# EAGLE design BME680_Breakout (EAGLE 7.6.0)
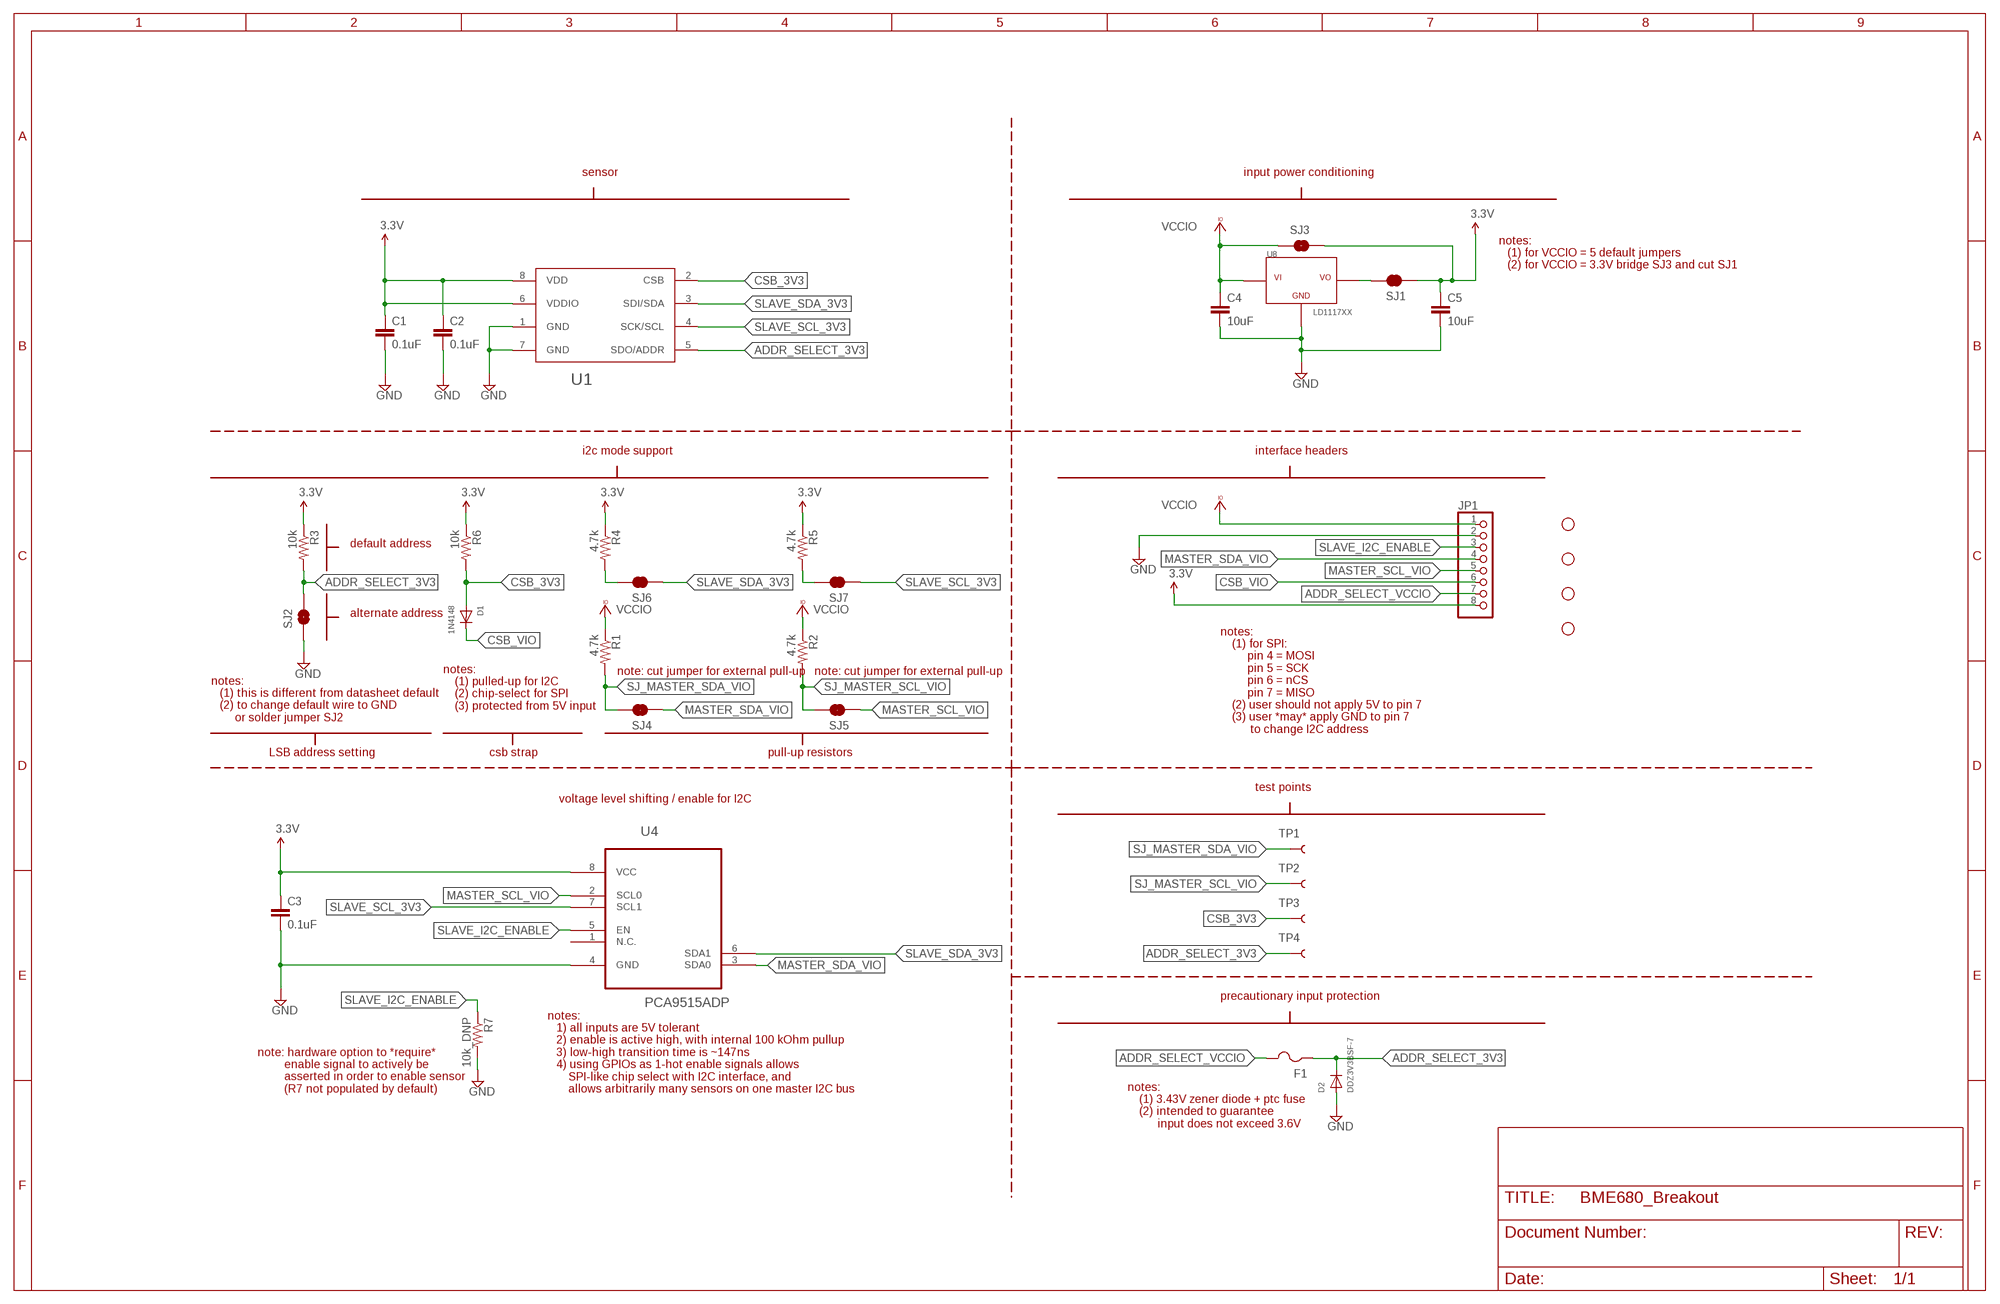
[diagram p0: schematic, sheet 1]

## Parts
C1  0.1uF  CAP0805  [0805]
C2  0.1uF  CAP0805  [0805]
C3  0.1uF  CAP0805  [0805]
C4  10uF  CAP0805  [0805]
C5  10uF  CAP0805  [0805]
D1  1N4148  DIODESOD-323F  [SOD-323F]
D2  DDZ3V3BSF-7  DIODESOD-323F  [SOD-323F]
F1  PTCFUSE-1812  [1812]
JP1  PINHD-1X8  [1X08]
R1  4.7k  RESISTOR0805-RES  [0805]
R2  4.7k  RESISTOR0805-RES  [0805]
R3  10k  RESISTOR0805-RES  [0805]
R4  4.7k  RESISTOR0805-RES  [0805]
R5  4.7k  RESISTOR0805-RES  [0805]
R6  10k  RESISTOR0805-RES  [0805]
R7  10k_DNP  RESISTOR0805-RES  [0805]
SJ1  JUMPER-PAD-2-NC_BY_TRACE  [PAD-JUMPER-2-NC_BY_TRACE_YES_SILK]
SJ2  JUMPER-PAD-2-NOYES_SILK  [PAD-JUMPER-2-NO_YES_SILK]
SJ3  SOLDERJUMPERNC2  [SJ_2S-NOTRACE]
SJ4  JUMPER-PAD-2-NC_BY_TRACE  [PAD-JUMPER-2-NC_BY_TRACE_YES_SILK]
SJ5  JUMPER-PAD-2-NC_BY_TRACE  [PAD-JUMPER-2-NC_BY_TRACE_YES_SILK]
SJ6  JUMPER-PAD-2-NC_BY_TRACE  [PAD-JUMPER-2-NC_BY_TRACE_YES_SILK]
SJ7  JUMPER-PAD-2-NC_BY_TRACE  [PAD-JUMPER-2-NC_BY_TRACE_YES_SILK]
STANDOFF1  STAND-OFF  [STAND-OFF]
STANDOFF2  STAND-OFF  [STAND-OFF]
STANDOFF3  STAND-OFF  [STAND-OFF]
STANDOFF4  STAND-OFF  [STAND-OFF]
TP1  TEST-POINT3X4  [PAD.03X.04]
TP2  TEST-POINT3X4  [PAD.03X.04]
TP3  TEST-POINT3X4  [PAD.03X.04]
TP4  TEST-POINT3X4  [PAD.03X.04]
U1  BME680  [BME680]
U4  PCA9515ADP  [SOT505-1]
U8  LD1117XX  [DPAK]

## Nets
3.3V: C1.1 C2.1 C3.1 C5.1 JP1.8 R3.1 R4.1 R5.1 R6.1 SJ1.1 SJ3.2 U1.6(VDDIO) U1.8(VDD) U4.8(VCC)
ADDR_SELECT_3V3: D2.C F1.1 R3.2 SJ2.2 TP4.P$1 U1.5(SDO/ADDR)
ADDR_SELECT_VCCIO: F1.2 JP1.7
CSB_3V3: D1.A R6.2 TP3.P$1 U1.2(CSB)
CSB_VIO: D1.C JP1.6
GND: C1.2 C2.2 C3.2 C4.2 C5.2 D2.A JP1.2 R7.2 SJ2.1 U1.1(GND) U1.7(GND) U4.4(GND) U8.1(GND)
MASTER_SCL_VIO: JP1.5 SJ5.1 U4.2(SCL0)
MASTER_SDA_VIO: JP1.4 SJ4.1 U4.3(SDA0)
N$1: SJ1.2 U8.4(VO)
N$3: R4.2 SJ6.2
N$4: R5.2 SJ7.2
SJ_MASTER_SCL_VIO: R2.2 SJ5.2 TP2.P$1
SJ_MASTER_SDA_VIO: R1.2 SJ4.2 TP1.P$1
SLAVE_I2C_ENABLE: JP1.3 R7.1 U4.5(EN)
SLAVE_SCL_3V3: SJ7.1 U1.4(SCK/SCL) U4.7(SCL1)
SLAVE_SDA_3V3: SJ6.1 U1.3(SDI/SDA) U4.6(SDA1)
VCCIO: C4.1 JP1.1 R1.1 R2.1 SJ3.1 U8.3(VI)
Unconnected: U4.1(N.C.)

## Notes on the sheet
- sensor | input power conditioning
- notes: 
     (1) for VCCIO = 5 default jumpers
     (2) for VCCIO = 3.3V bridge SJ3 and cut SJ1
- i2c mode support | interface headers
- default address
- alternate address
- note: cut jumper for external pull-up | note: cut jumper for external pull-up
- notes:
      (1) pulled-up for I2C
      (2) chip-select for SPI
      (3) protected from 5V input
- notes:
     (1) this is different from datasheet default
     (2) to change default wire to GND
          or solder jumper SJ2
- notes:
      (1) for SPI:
           pin 4 = MOSI
           pin 5 = SCK
           pin 6 = nCS
           pin 7 = MISO
      (2) user should not apply 5V to pin 7
      (3) user *may* apply GND to pin 7
            to change I2C address
- LSB address setting | csb strap | pull-up resistors
- test points
- voltage level shifting / enable for I2C
- precautionary input protection
- note: hardware option to *require* 
           enable signal to actively be 
           asserted in order to enable sensor
           (R7 not populated by default)
- notes:
     1) all inputs are 5V tolerant
     2) enable is active high, with internal 100 kOhm pullup
     3) low-high transition time is ~147ns
     4) using GPIOs as 1-hot enable signals allows
         SPI-like chip select with I2C interface, and
         allows arbitrarily many sensors on one master I2C bus
- notes: 
      (1) 3.43V zener diode + ptc fuse
      (2) intended to guarantee
            input does not exceed 3.6V

## Library data of the parts
C1-C5 = SparkFun-Passives:CAP: Capacitor Standard 0603 ceramic capacitor, and 0.1" leaded capacitor.
D1 D2 = adafruit:DIODE: Diode SMADIODE - SMA Surface Mount Package 20V 1A Schottky Diode Digikey: 641-1014-6-ND DO-1N4148 - Through Hole Small Current Diode SOD-123 20V 1 A (.5mV Vf) Schottky Diode - Digikey: MBRX120TPMSCT-ND SOD-323 10V 570mA (.38mV Vf, 3ns) Schottky Diode - Digikey: ZLLS410CT-ND SOD-523 30V 30mA Schottky Diode (RB751S-40TE61) - Digikey: RB751S-40TE61CT-ND SOT23-R/W - SOT23 Package (R = Solder Paste/Reflow Ovens, W = Hand-Soldering) BAT54Film 40V 300mA - Digikey: 497-7162-1-ND
F1 = adafruit:PTCFUSE: PTC fuses, resettable thermistors
JP1 = pinhead:PINHD-1X8: PIN HEADER
R1-R7 = SparkFun-Passives:RESISTOR: Resistor Basic schematic elements and footprints for 0603, 1206, and PTH resistors.
SJ1 SJ4-SJ7 = SparkFun-Passives:JUMPER-PAD-2-NC_BY_TRACE
SJ2 = SparkFun-Passives:JUMPER-PAD-2-NO
SJ3 = SparkFun-Retired:SOLDERJUMPER: Solder Jumper Standard SMD solder jumper. Used to automate production. Two varients : Normally Open and Normally Closed are the same, but have different paste layers. NC will have a large amount of paste and should jumper during reflow.
STANDOFF1-STANDOFF4 = SparkFun-Electromechanical:STAND-OFF: #4 Stand Off This is the mechanical footprint for a #4 phillips button head screw. Use the keepout ring to avoid running the screw head into surrounding components. SKU : PRT-00447
TP1-TP4 = SparkFun-Passives:TEST-POINT: Bare copper test points for troubleshooting or ICT
U1 = wicked-device:BME680
U4 = PCA9515ADP:PCA9515A
U8 = wicked-device:LD1117XX

## Board
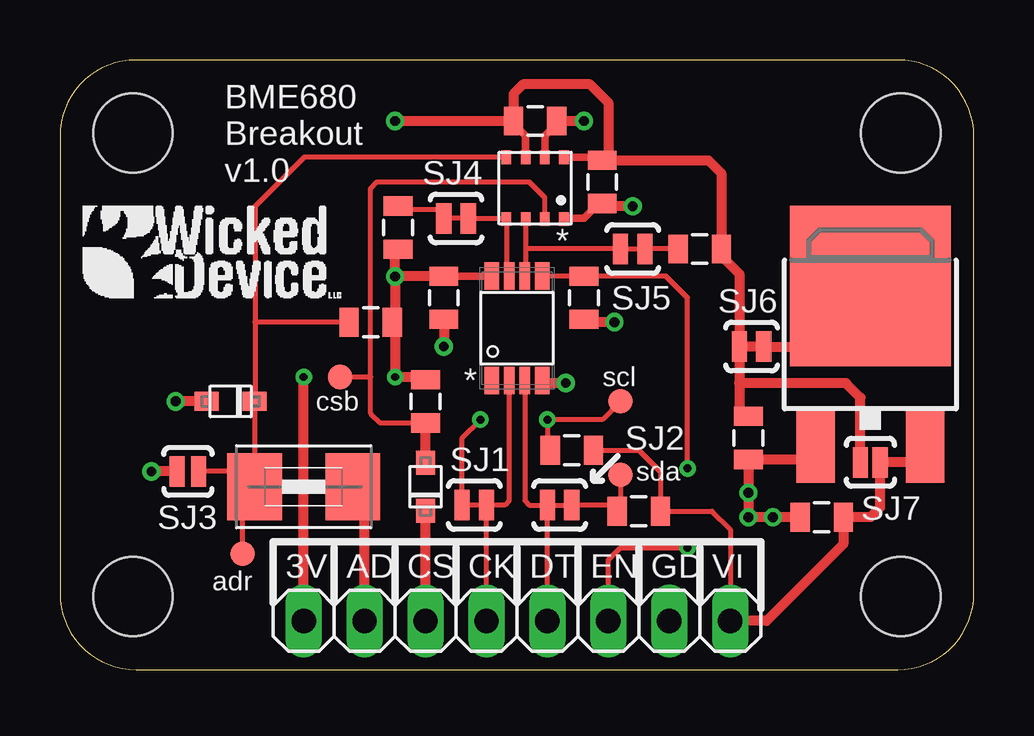
[diagram p1: board, top side]
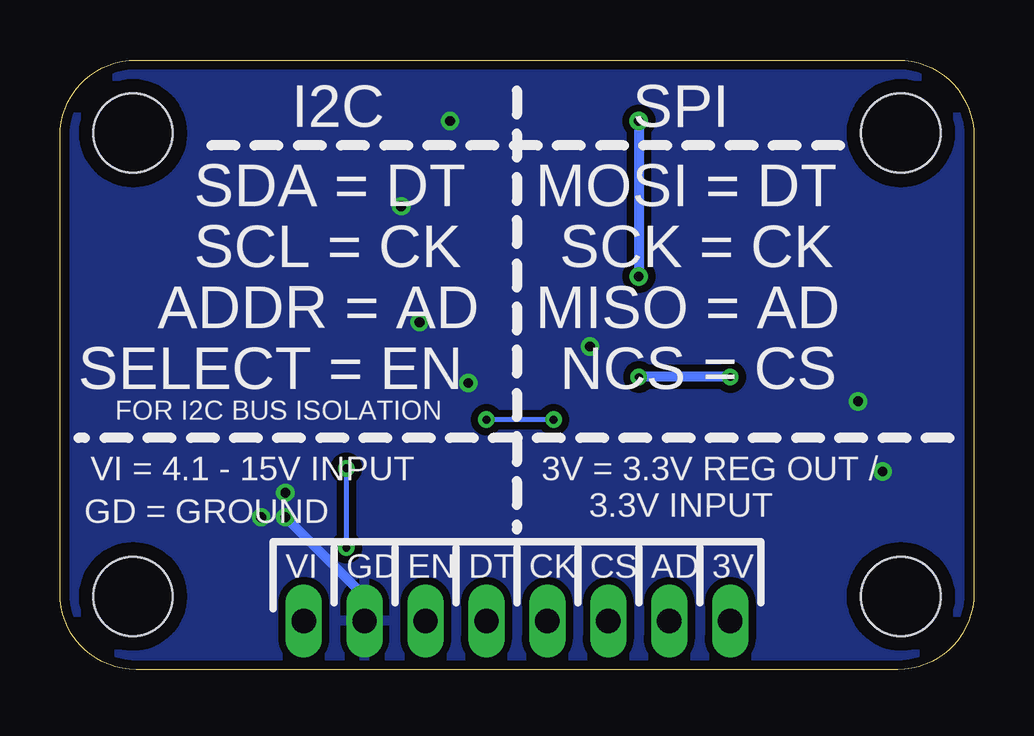
[diagram p2: board, bottom side, seen from below]

Size 38.1 x 25.4 mm. Coordinates in mm from the lower left corner, seen from the top.
Outline: 0,22.23 0,3.17 arc90 3.17,0 34.92,0 arc90 38.1,3.17 38.1,22.23 arc90 34.92,25.4 3.17,25.4 arc90 0,22.23
Copper layers (1*16): Top 0.0356mm / dielectric 1.5011mm / Bottom 0.0356mm
Design rules "oshpark-2layer *": minimum track width 6mil, minimum drill 13mil, track to track 6mil, track to pad 6mil, pad to pad 6mil, via to via 6mil, smd to smd 6mil, copper to edge 15mil, drill to drill 6mil, minimum pad ring 7mil, minimum via ring 7mil, stop-mask expansion 2.5mil, vias tented up to drill 16mil, thermal gap 10mil

### Footprints (pad centres in the part's own frame; a part is rotated, then mirrored left to right if it is on the bottom)
0805 = smd 0.8 x 1.2: 1 -0.9,0; 2 0.9,0
SOD-323F = smd 1 x 0.8: A -1,0; C 1,0
1812 = smd 2.286 x 2.794: 1 -2.046,0; 2 2.046,0
1X08 = drill 1.016 long: 1 -8.89,0; 2 -6.35,0; 3 -3.81,0; 4 -1.27,0; 5 1.27,0; 6 3.81,0; 7 6.35,0; 8 8.89,0
PAD-JUMPER-2-NC_BY_TRACE_YES_SILK = smd 0.635 x 1.27: 1 -0.508,0; 2 0.508,0
PAD-JUMPER-2-NO_YES_SILK = smd 0.635 x 1.27: 1 -0.45,0; 2 0.45,0
SJ_2S-NOTRACE = smd 0.635 x 1.27: 1 -0.401,0; 2 0.413,0
STAND-OFF = hole 3.302: 0,0
PAD.03X.04 = smd 1.016 x 1.016: P$1 0,0
BME680 = smd 0.575 x 0.4: 1 1.288,1.2; 2 1.288,0.4; 3 1.288,-0.4; 4 1.288,-1.2; 5 -1.288,-1.2; 6 -1.288,-0.4; 7 -1.288,0.4; 8 -1.288,1.2
SOT505-1 = smd 0.6 x 1.15: 1 -1.05,-2.175; 4 1.05,-2.175; 5 1.05,2.175; 8 -1.05,2.175 | smd 0.45 x 1.15: 2 -0.325,-2.175; 3 0.325,-2.175; 6 0.325,2.175; 7 -0.325,2.175
DPAK = smd 1.6 x 3: 1 -2.28,-2.91; 3 2.28,-2.91 | smd 6.7 x 6.7: 4 0,3.788

### Placement (x,y rotation side)
C1  19.81,22.86 0 top
C2  22.61,20.32 270 top
C3  16,15.49 270 top
C4  31.75,6.35 180 top
C5  28.7,9.65 270 top
D1  15.24,7.62 270 top
D2  7.11,11.18 0 top
F1  10.16,7.62 0 top
JP1  19.05,2.03 180 top
R1  24.13,6.6 180 top
R2  21.34,9.14 180 top
R3  12.95,14.48 180 top
R4  26.67,17.53 180 top
R5  14.1,18.41 90 top
R6  15.24,11.18 270 top
R7  21.84,15.49 270 top
SJ1  28.83,13.46 0 top
SJ2  5.33,8.26 0 top
SJ3  33.78,8.64 180 top
SJ4  20.83,6.86 0 top
SJ5  17.27,6.86 180 top
SJ6  23.88,17.53 0 top
SJ7  16.51,18.8 180 top
STANDOFF1  35.05,22.35 0 top
STANDOFF2  3.05,22.35 0 top
STANDOFF3  3.05,3.05 0 top
STANDOFF4  35.05,3.05 0 top
TP1  23.37,8.13 0 top
TP2  23.37,11.18 0 top
TP3  11.68,12.19 0 top
TP4  7.62,4.83 0 top
U1  19.81,20.07 270 top
U4  19.05,14.22 0 top
U8  33.78,12.19 0 top
U$1  [WICKEDLOGOTYPE2]  0.76,15.24 0 top

### Tracks (layer width: path | path; a pad name or v marks a point on that pad's centre or on a via)
3.3V  (via drill 0.33, 0.41)
  Top 0.305: U1.6 19.41,22.24 18.91,22.74 C1.1 | U1.8 22.47,21.35 C2.1 | 15.86,16.39 C3.1 U4.8
  Top 0.406: JP1.8 v10.16,12.19 | R6.1 15.12,12.19 v13.97,12.19 13.97,14.59 | SJ3.2 33.37,11.34 32.77,11.94 28.32,11.94 | v13.97,22.86 C1.1 18.91,23.99 19.3,24.38 22.1,24.38 22.86,23.62 22.86,21.22 C2.1 27.04,21.22 27.57,20.69 R4.1 27.43,17.39 28.32,16.5 SJ1.1 28.32,11.94 | 14.09,17.64 R5.1 13.97,17.52 v13.97,16.38 | 15.86,16.39 13.98,16.39 v13.97,16.38 | v13.97,16.38 13.97,14.59 | 13.97,14.59 R3.1 | 28.45,10.55 C5.1 28.32,10.55 28.32,11.94
  Bottom 0.406: v10.16,12.19 v13.97,12.19 | v13.97,22.86 v13.97,16.38
ADDR_SELECT_3V3
  Top 0.203: U1.5 10.18,21.35 8.13,19.3 8.13,14.48 | 8.13,14.48 8.13,11.19 D2.C F1.1 7.62,7.62 | R3.2 8.13,14.48 | TP4.P$1 7.62,7.62 | 7.62,7.62 7.62,7.87 7.24,8.26 SJ2.2
  Top 0.406: F1.1 7.8,7.93
ADDR_SELECT_VCCIO
  Top 0.406: JP1.7 12.7,7.13 F1.2
CSB_3V3
  Top 0.203: U1.2 20.21,19.67 19.56,20.32 13.21,20.32 12.95,20.07 12.95,12.19 | R6.2 13.35,10.28 12.95,10.67 12.95,12.19 | TP3.P$1 12.95,12.19
  Top 0.406: D1.A R6.2
CSB_VIO
  Top 0.406: JP1.6 D1.C
GND  (via drill 0.41)
  Top 0.203: 4.83,8.31 SJ2.1
  Top 0.305: U1.7 20.21,22.24 20.71,22.74 C1.2 | C2.2 22.47,19.42 21.84,18.8 21.03,18.8 U1.1
  Top 0.406: U8.1 31.5,8.64 31.38,8.75 C5.2 v28.7,7.37 v28.7,6.35 v29.72,6.35 C4.2 | v23.88,19.3 22.72,19.3 C2.2 | C1.2 v21.84,22.86 | C3.2 v16,13.46 | v21.08,11.94 20.1,11.94 U4.4 | v23.11,14.48 21.84,14.48 R7.2 | D2.A v4.83,11.18 | 4.83,8.31 4.83,8.26 v3.81,8.26
  Bottom 0.406: JP1.2 25.4,3.05 v28.7,6.35
  pour Bottom (isolate 0.305): -1.27,26.67 39.37,26.67 39.37,-1.27 -1.27,-1.27
MASTER_SCL_VIO
  Top 0.203: JP1.5 SJ5.1 18.54,6.86 18.73,7.04 U4.2
MASTER_SDA_VIO
  Top 0.203: JP1.4 SJ4.1 19.56,6.86 19.38,7.04 U4.3
N$1
  Top 0.406: 31.5,12.95 31.62,13.08 | 31.62,13.08 33.78,15.24 U8.4 | SJ1.2 31.11,13.46 31.11,13.08 31.62,13.08
N$2
  Top 0.406: 29.46,13.46 28.45,13.46
N$3
  Top 0.203: R4.2 SJ6.2
N$4
  Top 0.203: R5.2 14.23,19.18 16,19.18 SJ7.2
SJ_MASTER_SCL_VIO  (via drill 0.33)
  Top 0.203: SJ5.2 16.76,9.65 v17.53,10.41 | R2.2 20.32,9.26 v20.32,10.41 22.61,10.41 TP2.P$1
  Bottom 0.203: v17.53,10.41 v20.32,10.41
SJ_MASTER_SDA_VIO
  Top 0.203: TP1.P$1 23.37,6.6 R1.2 22.98,6.86 SJ4.2
SLAVE_I2C_ENABLE  (via drill 0.33)
  Top 0.203: 21.98,16.26 R7.1 | R7.1 U4.5 | JP1.3 22.86,4.57 23.37,5.08 v26.16,5.08 | v26.16,8.38 26.16,15.49 25.26,16.39 R7.1
  Bottom 0.203: v26.16,5.08 v26.16,8.38
SLAVE_SCL_3V3
  Top 0.203: U4.7 18.61,16.51 U1.4 17.04,18.78 SJ7.1
SLAVE_SDA_3V3
  Top 0.203: U1.3 19.41,17.53 | 19.41,17.53 19.41,16.44 U4.6 | SJ6.1 19.41,17.53
VCCIO
  Top 0.203: R2.1 24.13,9.14 25.03,8.24 R1.1 27.18,6.6 27.94,5.84 JP1.1
  Top 0.406: U8.3 36.07,8.64 SJ3.1 34.18,6.75 33.78,6.35 C4.1 32.65,5.22 29.46,2.03 JP1.1

### Text on the board
tPlace: BME680 / Breakout / v1.0 | SJ4 | * | SJ5 | SJ6 | * | scl | csb | SJ2 | SJ1 | sda | SJ3 | SJ7 | 3V | AD | CS | CK | DT | EN | GD | VI | adr
bPlace: SPI | I2C | MOSI = DT | SDA = DT | SCK = CK | SCL = CK | MISO = AD | ADDR = AD | NCS = CS | SELECT = EN | FOR I2C BUS ISOLATION | VI = 4.1 - 15V INPUT | 3V = 3.3V REG OUT / / 3.3V INPUT | GD = GROUND | 3V | AD | CS | CK | DT | EN | GD | VI